# EAGLE schematic ai_breakout_rpibplus (EAGLE 7.1.0)
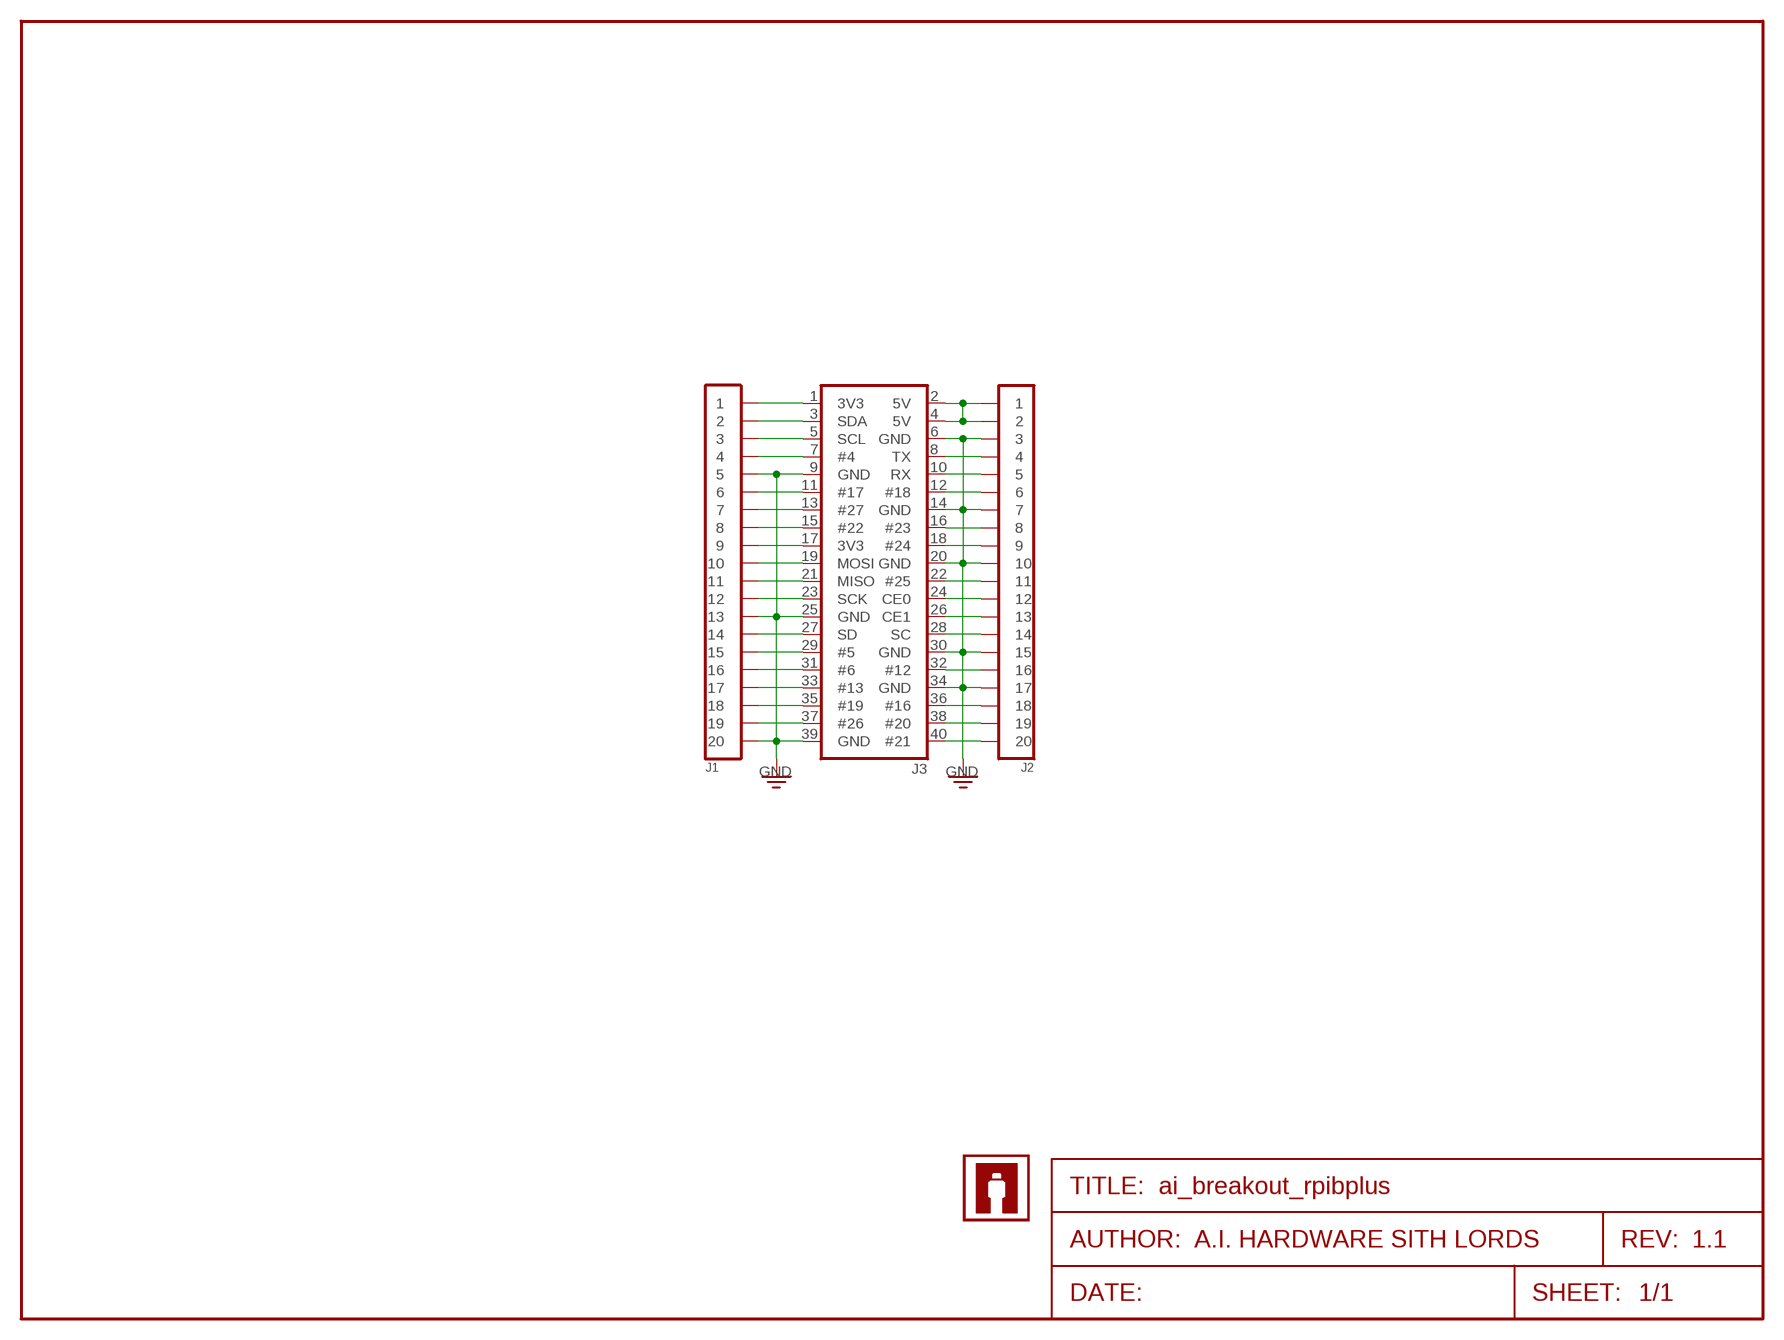
[diagram p0: schematic, sheet 1]
FRAME1 (FRAME-LETTER): AUTHOR: A.I. HARDWARE SITH LORDS; REV: 1.1

## Parts
J1  1X20  [1X20]
J2  1X20NOFIRST  [1X20-NOFIRST]
J3  2X20-RPI-BRK  [2X20-RPI-BRK]
U$1  AI-LOGOXS  [AI-LOGO-XS]
U$2  AI-LOGOXS  [AI-LOGO-XS]

## Nets
GND: J1.5 J1.13 J1.20 J2.3 J2.7 J2.10 J2.15 J2.17 J3.6(GND) J3.9(GND) J3.14(GND) J3.20(GND) J3.25(GND) J3.30(GND) J3.34(GND) J3.39(GND)
N$1: J2.1 J2.2 J3.2(5V) J3.4(5V)
N$2: J1.19 J3.37(#26)
N$4: J1.18 J3.35(#19)
N$6: J1.17 J3.33(#13)
N$9: J1.16 J3.31(#6)
N$12: J1.15 J3.29(#5)
N$13: J1.14 J3.27(SD)
N$15: J1.12 J3.23(SCK)
N$16: J1.11 J3.21(MISO)
N$17: J1.10 J3.19(MOSI)
N$18: J1.9 J3.17(3V3)
N$19: J1.8 J3.15(#22)
N$20: J1.7 J3.13(#27)
N$21: J1.1 J3.1(3V3)
N$22: J1.2 J3.3(SDA)
N$23: J1.3 J3.5(SCL)
N$24: J1.4 J3.7(#4)
N$26: J1.6 J3.11(#17)
N$28: J2.8 J3.16(#23)
N$29: J2.16 J3.32(#12)
N$30: J2.4 J3.8(TX)
N$31: J2.5 J3.10(RX)
N$32: J2.6 J3.12(#18)
N$35: J2.9 J3.18(#24)
N$37: J2.11 J3.22(#25)
N$38: J2.12 J3.24(CE0)
N$39: J2.13 J3.26(CE1)
N$40: J2.14 J3.28(SC)
N$44: J2.18 J3.36(#16)
N$45: J2.19 J3.38(#20)
N$46: J2.20 J3.40(#21)

## Library data of the parts
J1 J2 = Ai_Connectors:1X20
J3 = Ai_Connectors:2X20-RPI
U$1 U$2 = Ai_Miscellany:AI-LOGO